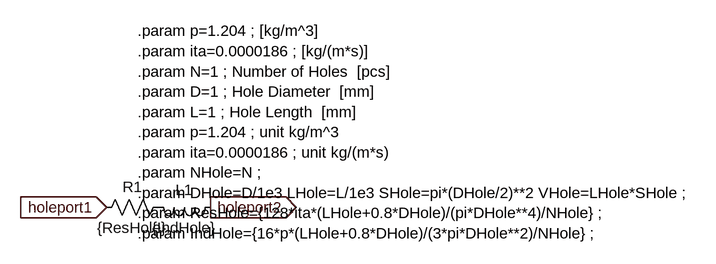
[diagram p0: schematic HoleModel.asc]
HoleModel.asc, the LTspice schematic file:
Version 4
SHEET 1 1216 680
FLAG 160 432 holeport1
IOPIN 160 432 In
FLAG 320 432 holeport2
IOPIN 320 432 Out
SYMBOL res 256 416 R90
WINDOW 0 0 56 VBottom 2
WINDOW 3 32 56 VTop 2
SYMATTR InstName R1
SYMATTR Value {ResHole}
SYMBOL ind 336 416 R90
WINDOW 0 5 56 VBottom 2
WINDOW 3 32 56 VTop 2
SYMATTR InstName L1
SYMATTR Value {IndHole}
TEXT 208 160 Left 2 !.param p=1.204 ; [kg/m^3]\n.param ita=0.0000186 ; [kg/(m*s)]\n.param N=1 ; Number of Holes  [pcs]\n.param D=1 ; Hole Diameter  [mm]\n.param L=1 ; Hole Length  [mm]\n.param p=1.204 ; unit kg/m^3\n.param ita=0.0000186 ; unit kg/(m*s)\n.param NHole=N ;\n.param DHole=D/1e3 LHole=L/1e3 SHole=pi*(DHole/2)**2 VHole=LHole*SHole ;\n.param ResHole={128*ita*(LHole+0.8*DHole)/(pi*DHole**4)/NHole} ;\n.param IndHole={16*p*(LHole+0.8*DHole)/(3*pi*DHole**2)/NHole} ;

The netlist it stands for:
* HoleModel.asc
R1 P001 holeport1 {ResHole}
L1 holeport2 P001 {IndHole}
.param p=1.204 ; [kg/m^3]
.param ita=0.0000186 ; [kg/(m*s)]
.param N=1 ; Number of Holes  [pcs]
.param D=1 ; Hole Diameter  [mm]
.param L=1 ; Hole Length  [mm]
.param p=1.204 ; unit kg/m^3
.param ita=0.0000186 ; unit kg/(m*s)
.param NHole=N ;
.param DHole=D/1e3 LHole=L/1e3 SHole=pi*(DHole/2)**2 VHole=LHole*SHole ;
.param ResHole={128*ita*(LHole+0.8*DHole)/(pi*DHole**4)/NHole} ;
.param IndHole={16*p*(LHole+0.8*DHole)/(3*pi*DHole**2)/NHole} ;
.backanno
.end